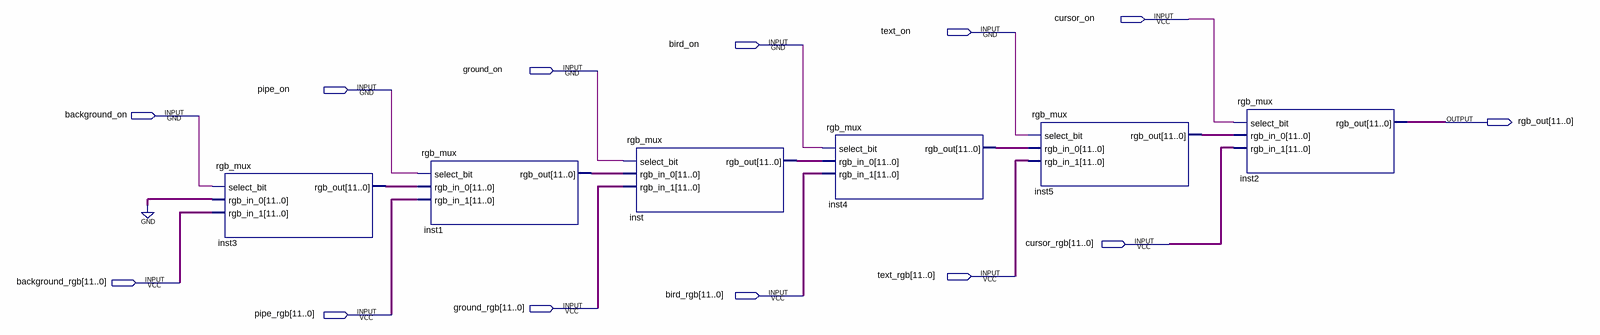
[diagram p0: schematic sheet]
// Quartus schematic rgb_output.bdf as structural Verilog: 6 symbols, 13 pins
module rgb_output (
  input  cursor_on,
  input  text_on,
  input  bird_on,
  input  ground_on,
  input  pipe_on,
  input  background_on,
  input  [11:0] cursor_rgb,
  input  [11:0] text_rgb,
  input  [11:0] background_rgb,
  input  [11:0] bird_rgb,
  input  [11:0] ground_rgb,
  input  [11:0] pipe_rgb,
  output [11:0] rgb_out
);

  wire [11:0] inst1_rgb_out, inst3_rgb_out, inst4_rgb_out, inst5_rgb_out, inst_rgb_out;

  rgb_mux inst3 (.select_bit(background_on), .rgb_in_0({12{1'b0}}), .rgb_in_1(background_rgb), .rgb_out(inst3_rgb_out));
  rgb_mux inst1 (.select_bit(pipe_on), .rgb_in_0(inst3_rgb_out), .rgb_in_1(pipe_rgb), .rgb_out(inst1_rgb_out));
  rgb_mux inst (.select_bit(ground_on), .rgb_in_0(inst1_rgb_out), .rgb_in_1(ground_rgb), .rgb_out(inst_rgb_out));
  rgb_mux inst4 (.select_bit(bird_on), .rgb_in_0(inst_rgb_out), .rgb_in_1(bird_rgb), .rgb_out(inst4_rgb_out));
  rgb_mux inst5 (.select_bit(text_on), .rgb_in_0(inst4_rgb_out), .rgb_in_1(text_rgb), .rgb_out(inst5_rgb_out));
  rgb_mux inst2 (.select_bit(cursor_on), .rgb_in_0(inst5_rgb_out), .rgb_in_1(cursor_rgb), .rgb_out(rgb_out));
endmodule
